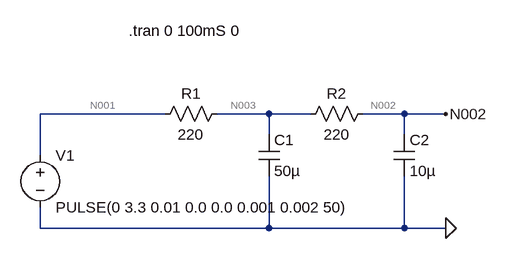
[diagram p0: schematic pwm_rc_filter.asc]
pwm_rc_filter.asc, the LTspice schematic file:
Version 4
SHEET 1 880 680
WIRE -736 176 -928 176
WIRE -576 176 -656 176
WIRE -512 176 -576 176
WIRE -368 176 -432 176
WIRE -304 176 -368 176
WIRE -576 208 -576 176
WIRE -368 208 -368 176
WIRE -928 240 -928 176
WIRE -368 352 -368 272
WIRE -928 352 -928 320
WIRE -576 352 -576 272
WIRE -576 352 -928 352
WIRE -368 352 -576 352
WIRE -304 352 -368 352
FLAG -304 352 0
IOPIN -304 352 Out
FLAG -304 176 N002
SYMBOL voltage -928 224 R0
SYMATTR InstName V1
SYMATTR Value PULSE(0 3.3 0.01 0.0 0.0 0.001 0.002 50)
SYMBOL cap -592 208 R0
SYMATTR InstName C1
SYMATTR Value 50µ
SYMATTR SpiceLine Rser=0 Lser=0 mfg="   ---" pn="   ---" type="   ---"
SYMBOL res -640 160 R90
WINDOW 0 0 56 VBottom 2
WINDOW 3 32 56 VTop 2
SYMATTR InstName R1
SYMATTR Value 220
SYMBOL res -416 160 R90
WINDOW 0 0 56 VBottom 2
WINDOW 3 32 56 VTop 2
SYMATTR InstName R2
SYMATTR Value 220
SYMBOL cap -384 208 R0
SYMATTR InstName C2
SYMATTR Value 10µ
TEXT -792 48 Left 2 !.tran 0 100mS 0

The netlist it stands for:
* pwm_rc_filter.asc
V1 N001 0 PULSE(0 3.3 0.01 0.0 0.0 0.001 0.002 50)
C1 N003 0 50µ Rser=0 Lser=0 mfg="   ---" pn="   ---" type="   ---"
R1 N003 N001 220
R2 N002 N003 220
C2 N002 0 10µ
.tran 0 100mS 0
.backanno
.end

* Results of the author's LTspice run, read from the files saved beside the schematic
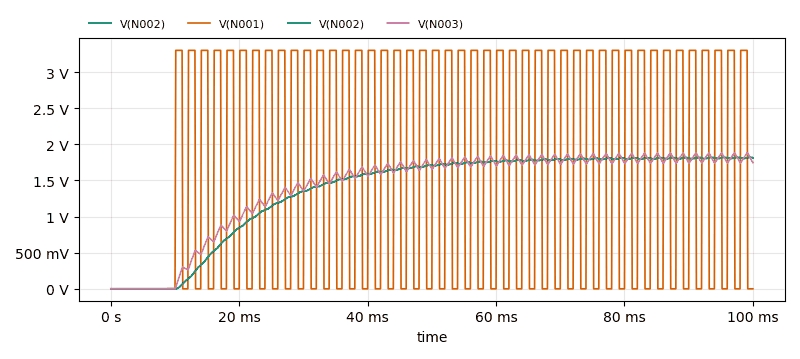
[diagram p1: Transient Analysis of pwm_rc_filter.asc, plotted from the saved traces]
* Transient Analysis, 1 run:
*   V(N002): min 0 V, max 1.82 V, average 1.361 V, rms 1.498 V, last 1.813 V
*   V(N001): min 0 V, max 3.3 V, average 1.633 V, rms 2.29 V, last 0 V
*   V(N002): min 0 V, max 1.82 V, average 1.361 V, rms 1.498 V, last 1.813 V
*   V(N003): min 0 V, max 1.881 V, average 1.401 V, rms 1.524 V, last 1.746 V